# Altium project 天面消防与门禁联动系统.PrjPcb
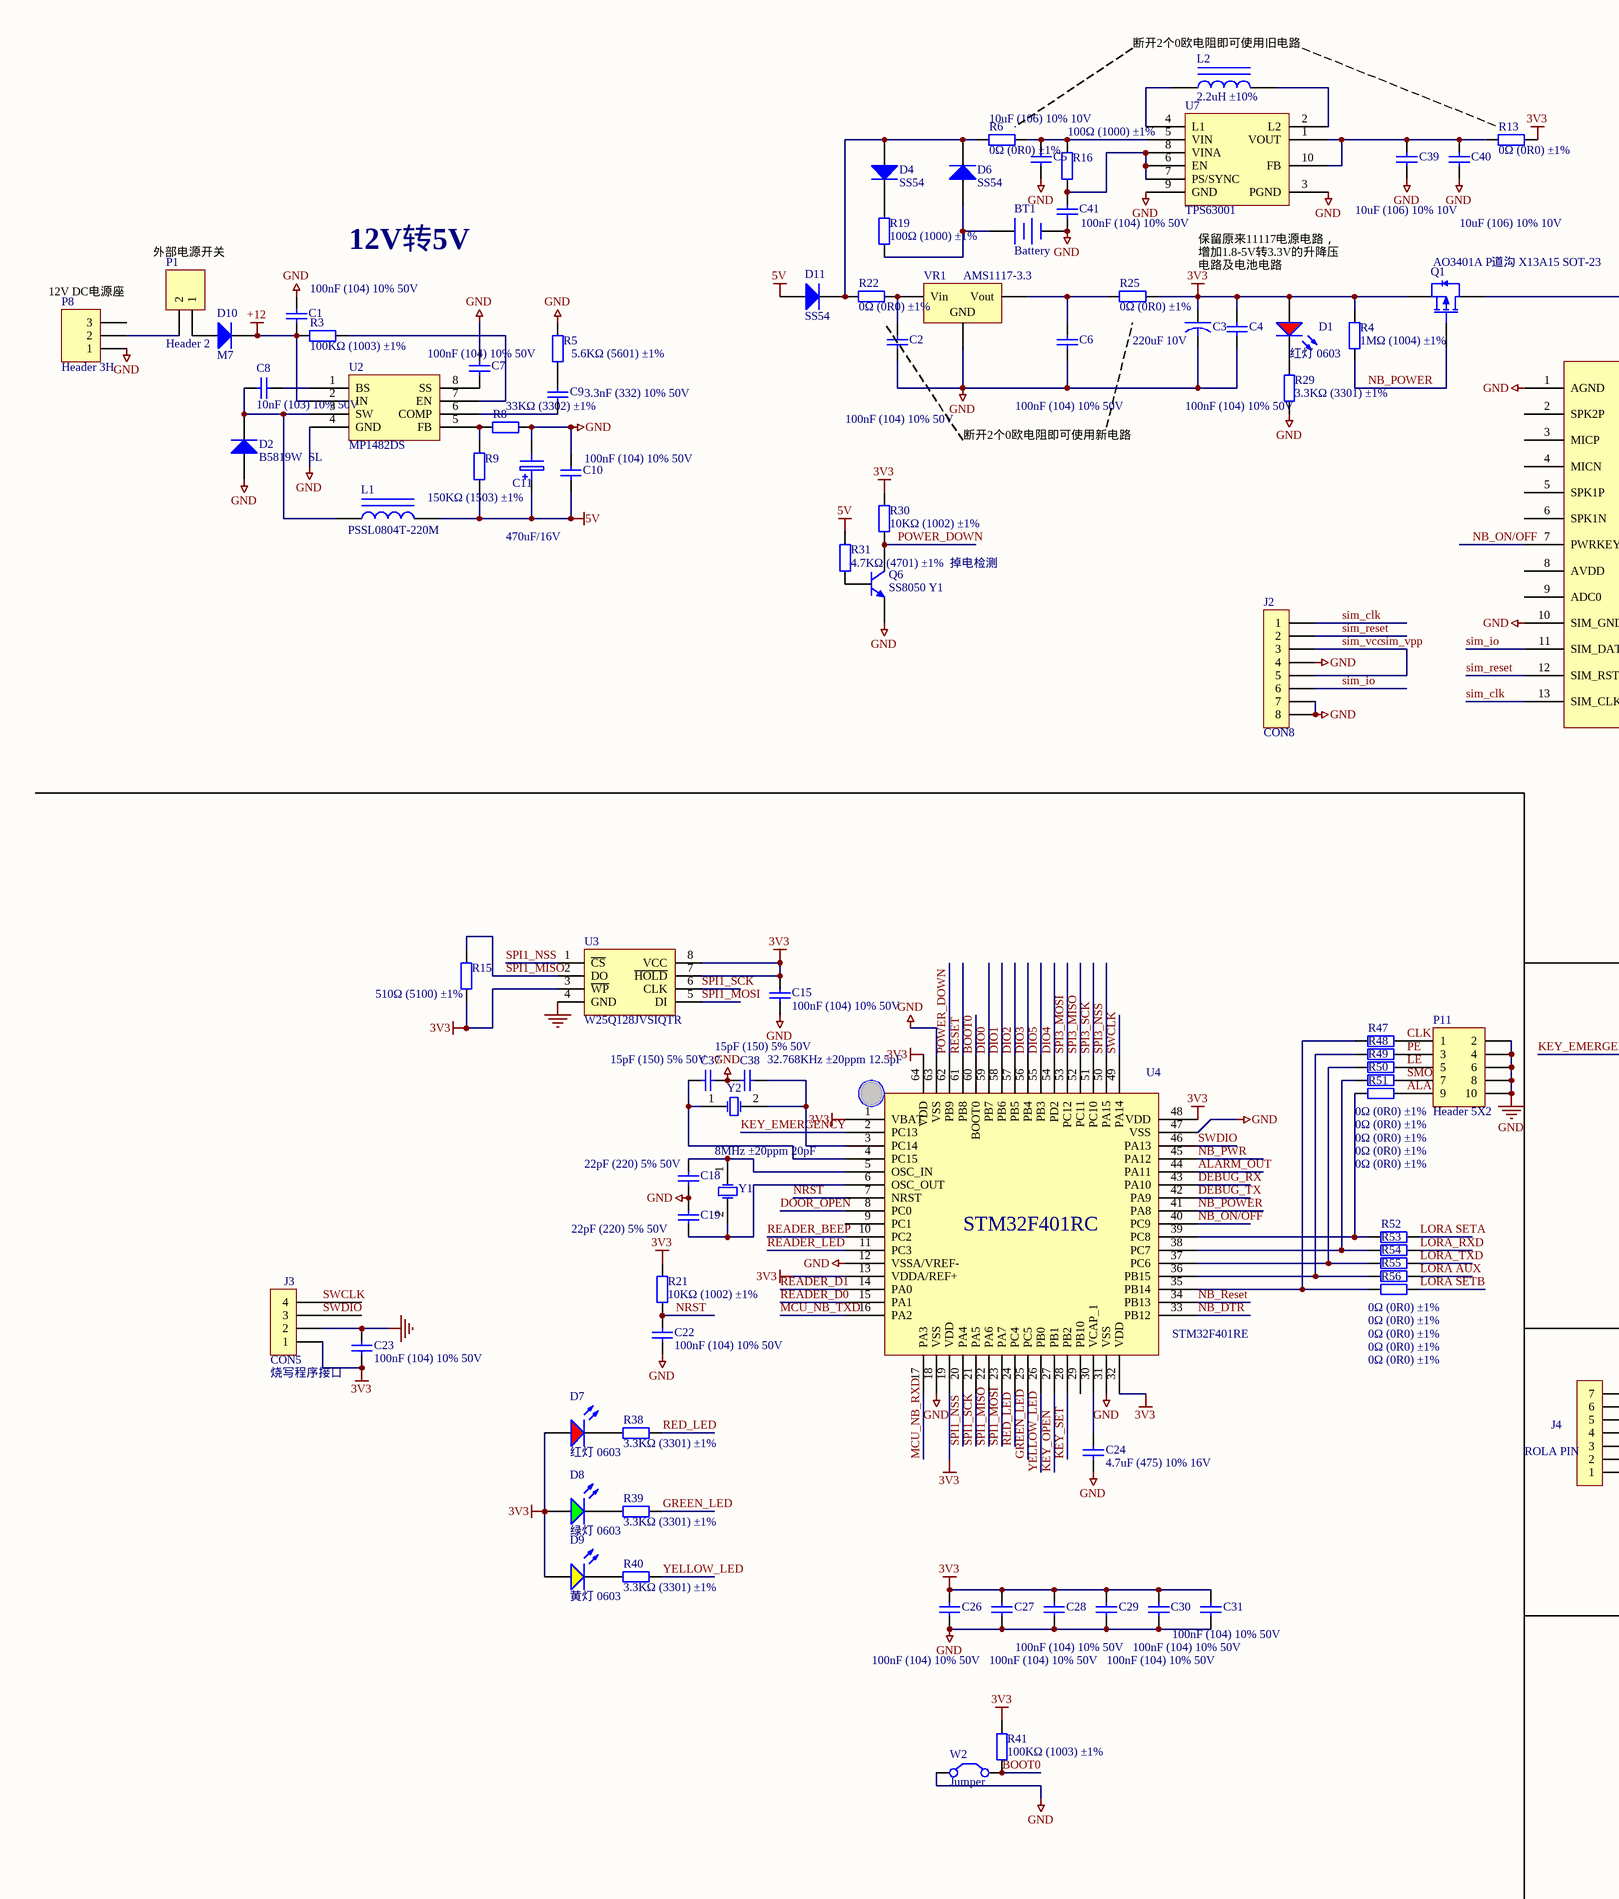
[diagram p0: sch.SchDoc, left]
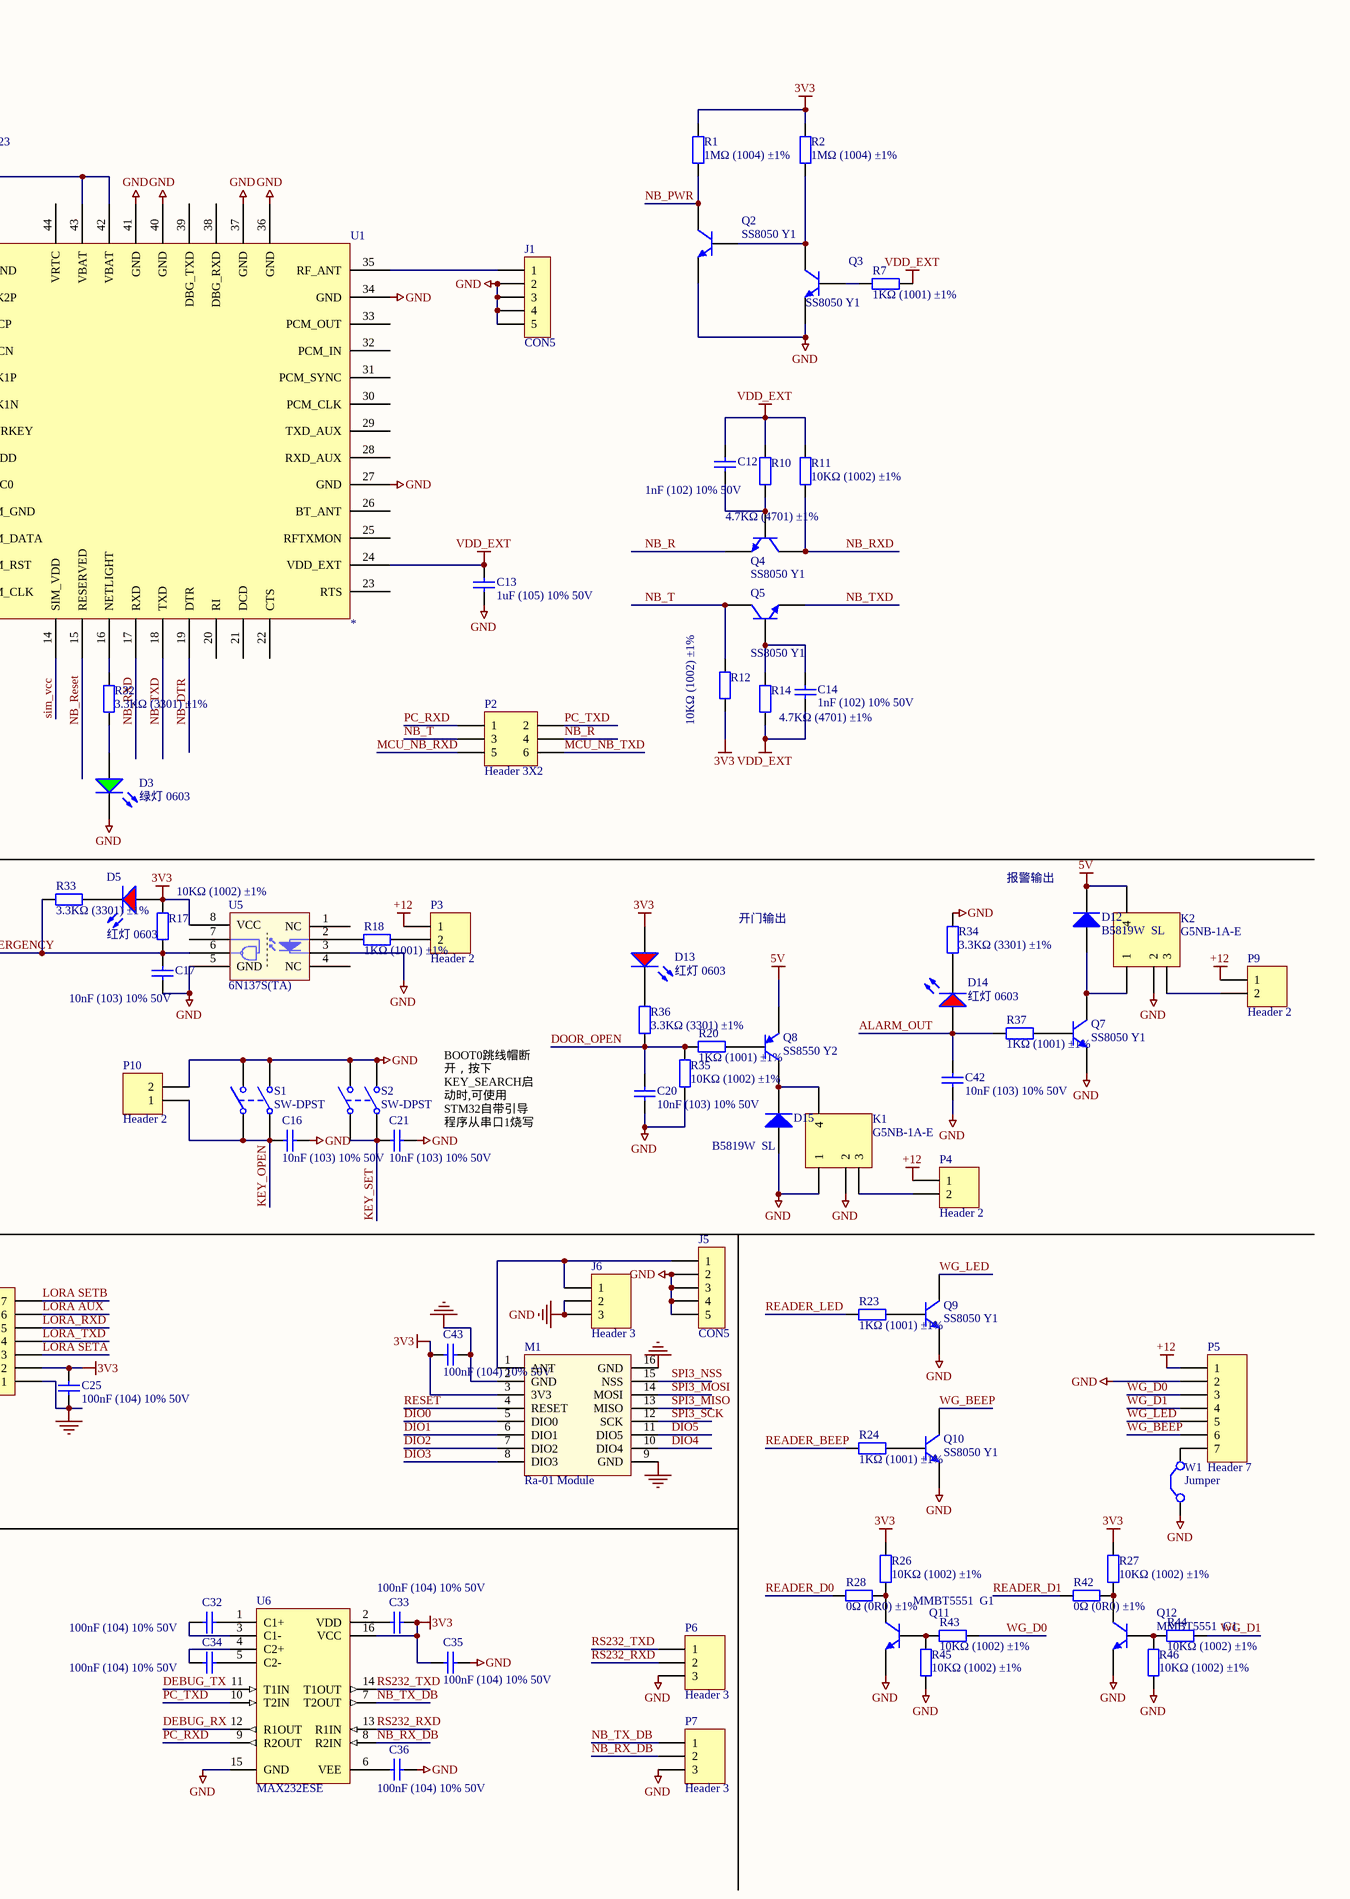
[diagram p1: sch.SchDoc, right]
1 sheet, 163 parts. Net scope: global (net labels, ports and power ports of the same name join across sheets).
Board file: PCB.PcbDoc

## Sheet sch.SchDoc
size A2

### Parts
BT1  Battery  [3V60R]
C1  100nF (104) 10% 50V  [0603_C]
C2  100nF (104) 10% 50V  [0603_C]
C3  220uF 10V  [153CLV-0807]
C4  100nF (104) 10% 50V  [0603_C]
C5  10uF (106) 10% 10V  [0603_C]
C6  100nF (104) 10% 50V  [0603_C]
C7  100nF (104) 10% 50V  [0603_C]
C8  10nF (103) 10% 50V  [0603_C]
C9  3.3nF (332) 10% 50V  [0603_C]
C10  100nF (104) 10% 50V  [0603_C]
C11  470uF/16V  [153CLV-0810]
C12  1nF (102) 10% 50V  [0603_C]
C13  1uF (105) 10% 50V  [0603_C]
C14  1nF (102) 10% 50V  [0603_C]
C15  100nF (104) 10% 50V  [0603_C]
C16  10nF (103) 10% 50V  [0603_C]
C17  10nF (103) 10% 50V  [0603_C]
C18  22pF (220) 5% 50V  [0603_C]
C19  22pF (220) 5% 50V  [0603_C]
C20  10nF (103) 10% 50V  [0603_C]
C21  10nF (103) 10% 50V  [0603_C]
C22  100nF (104) 10% 50V  [0603_C]
C23  100nF (104) 10% 50V  [0603_C]
C24  4.7uF (475) 10% 16V  [0603_C]
C25  100nF (104) 10% 50V  [0603_C]
C26  100nF (104) 10% 50V  [0603_C]
C27  100nF (104) 10% 50V  [0603_C]
C28  100nF (104) 10% 50V  [0603_C]
C29  100nF (104) 10% 50V  [0603_C]
C30  100nF (104) 10% 50V  [0603_C]
C31  100nF (104) 10% 50V  [0603_C]
C32  100nF (104) 10% 50V  [0603_C]
C33  100nF (104) 10% 50V  [0603_C]
C34  100nF (104) 10% 50V  [0603_C]
C35  100nF (104) 10% 50V  [0603_C]
C36  100nF (104) 10% 50V  [0603_C]
C37  15pF (150) 5% 50V  [0603_C]
C38  15pF (150) 5% 50V  [0603_C]
C39  10uF (106) 10% 10V  [0603_C]
C40  10uF (106) 10% 10V  [0603_C]
C41  100nF (104) 10% 50V  [0603_C]
C42  10nF (103) 10% 50V  [0603_C]
C43  100nF (104) 10% 50V  [0603_C]
D1  红灯 0603  [0603_LED_S1]
D2  B5819W  SL  [SOD-123]
D3  绿灯 0603  [0603_LED_S1]
D4  SS54  [SMA(DO-214AC)_S1]
D5  红灯 0603  [0603_LED_S1]
D6  SS54  [SMA(DO-214AC)_S1]
D7  红灯 0603  [0603_LED_S1]
D8  绿灯 0603  [0603_LED_S1]
D9  黄灯 0603  [0603_LED_S1]
D10  M7  [SMA(DO-214AC)_S1]
D11  SS54  [SMA(DO-214AC)_S1]
D12  B5819W  SL  [SOD-123]
D13  红灯 0603  [0603_LED_S1]
D14  红灯 0603  [0603_LED_S1]
D15  B5819W  SL  [SOD-123]
J1  CON5  [T-5P]
J2  CON8  [NANOSIM]
J3  CON5  [SIP4]
J4  ROLA PIN  [ROLA MODULE]
J5  CON5  [T-5P]
J6  Header 3  [COAXIAL/SMD/CON/V/I-PEX/W08-5801]
K1  G5NB-1A-E  [G5NB-1A]
K2  G5NB-1A-E  [G5NB-1A]
L1  PSSL0804T-220M  [L7-8]
L2  2.2uH ±10%  [L4532M]
M1  Ra-01 Module  [Ra-01 Module]
P1  Header 2  [MSTBV2]
P2  Header 3X2  [HDR2X3]
P3  Header 2  [MSTBV2]
P4  Header 2  [MSTBV2]
P5  Header 7  [MSTBV7]
P6  Header 3  [HDR1X3]
P7  Header 3  [HDR1X3]
P8  Header 3H  [POWER_SOCK _INSERT_5]
P9  Header 2  [MSTBV2]
P10  Header 2  [MSTBV2]
P11  Header 5X2  [ML10]
Q1  AO3401A P道沟 X13A15 SOT-23  [SOT-23-3L]
Q2  SS8050 Y1  [SOT-23(SOT-23-3)]
Q3  SS8050 Y1  [SOT-23(SOT-23-3)]
Q4  SS8050 Y1  [SOT-23(SOT-23-3)]
Q5  SS8050 Y1  [SOT-23(SOT-23-3)]
Q6  SS8050 Y1  [SOT-23(SOT-23-3)]
Q7  SS8050 Y1  [SOT-23(SOT-23-3)]
Q8  SS8550 Y2  [SOT-23(SOT-23-3)]
Q9  SS8050 Y1  [SOT-23(SOT-23-3)]
Q10  SS8050 Y1  [SOT-23(SOT-23-3)]
Q11  MMBT5551  G1  [SOT-23(SOT-23-3)]
Q12  MMBT5551  G1  [SOT-23(SOT-23-3)]
R1  1MΩ (1004) ±1%  [0603_R]
R2  1MΩ (1004) ±1%  [0603_R]
R3  100KΩ (1003) ±1%  [0603_R]
R4  1MΩ (1004) ±1%  [0603_R]
R5  5.6KΩ (5601) ±1%  [0603_R]
R6  0Ω (0R0) ±1%  [0603_R]
R7  1KΩ (1001) ±1%  [0603_R]
R8  33KΩ (3302) ±1%  [0603_R]
R9  150KΩ (1503) ±1%  [0603_R]
R10  4.7KΩ (4701) ±1%  [0603_R]
R11  10KΩ (1002) ±1%  [0603_R]
R12  10KΩ (1002) ±1%  [0603_R]
R13  0Ω (0R0) ±1%  [0603_R]
R14  4.7KΩ (4701) ±1%  [0603_R]
R15  510Ω (5100) ±1%  [0603_R]
R16  100Ω (1000) ±1%  [0603_R]
R17  10KΩ (1002) ±1%  [0603_R]
R18  1KΩ (1001) ±1%  [1206_R]
R19  100Ω (1000) ±1%  [0805_R]
R20  1KΩ (1001) ±1%  [0603_R]
R21  10KΩ (1002) ±1%  [0603_R]
R22  0Ω (0R0) ±1%  [0603_R]
R23  1KΩ (1001) ±1%  [0603_R]
R24  1KΩ (1001) ±1%  [0603_R]
R25  0Ω (0R0) ±1%  [0603_R]
R26  10KΩ (1002) ±1%  [0603_R]
R27  10KΩ (1002) ±1%  [0603_R]
R28  0Ω (0R0) ±1%  [0603_R]
R29  3.3KΩ (3301) ±1%  [0603_R]
R30  10KΩ (1002) ±1%  [0603_R]
R31  4.7KΩ (4701) ±1%  [0603_R]
R32  3.3KΩ (3301) ±1%  [0603_R]
R33  3.3KΩ (3301) ±1%  [0603_R]
R34  3.3KΩ (3301) ±1%  [0603_R]
R35  10KΩ (1002) ±1%  [0603_R]
R36  3.3KΩ (3301) ±1%  [0603_R]
R37  1KΩ (1001) ±1%  [0603_R]
R38  3.3KΩ (3301) ±1%  [0603_R]
R39  3.3KΩ (3301) ±1%  [0603_R]
R40  3.3KΩ (3301) ±1%  [0603_R]
R41  100KΩ (1003) ±1%  [0603_R]
R42  0Ω (0R0) ±1%  [0603_R]
R43  10KΩ (1002) ±1%  [0603_R]
R44  10KΩ (1002) ±1%  [0603_R]
R45  10KΩ (1002) ±1%  [0603_R]
R46  10KΩ (1002) ±1%  [0603_R]
R47  0Ω (0R0) ±1%  [0603_R]
R48  0Ω (0R0) ±1%  [0603_R]
R49  0Ω (0R0) ±1%  [0603_R]
R50  0Ω (0R0) ±1%  [0603_R]
R51  0Ω (0R0) ±1%  [0603_R]
R52  0Ω (0R0) ±1%  [0603_R]
R53  0Ω (0R0) ±1%  [0603_R]
R54  0Ω (0R0) ±1%  [0603_R]
R55  0Ω (0R0) ±1%  [0603_R]
R56  0Ω (0R0) ±1%  [0603_R]
S1  SW-DPST  [12*12_key]
S2  SW-DPST  [12*12_key]
U1  *  [M26]
U2  MP1482DS  [SOIC-8_150mil]
U3  W25Q128JVSIQTR  [SOIC-8_208mil]
U4  STM32F401RE  [LQFP64]
U5  6N137S(TA)  [SMD-8_6.3mm]
U6  MAX232ESE  [SOIC-16_150mil]
U7  TPS63001  [DRC-S-PVSON-N10]
VR1  AMS1117-3.3  [SOT-223]
W1  Jumper  [JP1]
W2  Jumper  [JP1]
Y1  8MHz ±20ppm 20pF  [SMD-5032_2P]
Y2  32.768KHz ±20ppm 12.5pF  [SMD-3215_2P FC - 135]

### Nets
3V3: C3.1 C4.2 C15.1 C23.1 C25.1 C26.2 C27.2 C28.2 C29.2 C30.2 C31.2 C33.2 C35.2 C43.1 D1.A D5.A D7.A D8.A D9.A D13.A J3.1 J4.2 M1.3(3V3) Q1.2(S) R1.2 R2.2 R4.2 R12.1 R13.2 R15.1 R17.1 R21.2 R25.2 R26.1 R27.1 R30.2 R41.2 U3.3(~{WP}) U3.7(~{HOLD}) U3.8(VCC) U4.1(VBAT) U4.13(VDDA/REF+) U4.19(VDD) U4.32(VDD) U4.48(VDD) U4.64(VDD) U5.8(VCC) U6.16(VCC)
5V: C10.1 C11.1 D11.1(A) D12.2(K) K2.4 L1.2 Q8.2(E) R9.2 R31.2
+12: C1.2 D10.2(K) P3.1 P4.1 P5.1 P9.1 R3.1 U2.2(IN)
GND: BT1.2(-) C1.1 C2.1 C3.2 C4.1 C5.2 C6.1 C7.1 C10.2 C11.2 C13.1 C15.2 C16.2 C17.1 C18.1 C19.2 C20.2 C21.2 C22.2 C23.2 C24.2 C25.2 C26.1 C27.1 C28.1 C29.1 C30.1 C31.1 C35.1 C36.2 C37.2 C38.1 C39.2 C40.2 C41.2 C42.2 C43.2 D2.1(A) D3.K D15.1(A) J1.2 J1.3 J1.4 J1.5 J2.4 J2.7 J2.8 J3.2 J4.1 J5.2 J5.3 J5.4 J5.5 J6.2 J6.3 K1.1 K1.2 K2.2 M1.2(GND) M1.9(GND) M1.16(GND) P5.2 P6.3 P7.3 P8.1 P10.2 P11.2 P11.4 P11.6 P11.8 P11.10 Q2.2(E) Q3.2(E) Q6.2(E) Q7.2(E) Q9.2(E) Q10.2(E) Q11.2(E) Q12.2(E) R5.2 R8.2 R29.2 R34.1 R35.1 R45.2 R46.2 S1.2(NO1) S1.4(NO2) S2.2(NO1) S2.4(NO2) U1.1(AGND) U1.10(SIM_GND) U1.27(GND) U1.34(GND) U1.36(GND) U1.37(GND) U1.40(GND) U1.41(GND) U2.4(GND) U3.4(GND) U4.12(VSSA/VREF-) U4.18(VSS) U4.31(VSS) U4.47(VSS) U4.63(VSS) U5.3(K) U5.5(GND) U6.15(GND) U7.3(PGND) U7.9(GND) VR1.1(GND) W1.1(C1) W2.1(C1)
VDD_EXT: C12.2 C13.2 C14.1 R7.2 R10.2 R11.2 R14.1 U1.24(VDD_EXT)
ALARM: P11.9 R51.2
ALARM_OUT: C42.1 D14.A R37.1 U4.44(PA11)
BOOT0: R41.1 U4.60(BOOT0) W2.2(C2)
CLK: P11.1 R47.2
DEBUG_RX: U4.43(PA10) U6.12(R1OUT)
DEBUG_TX: U4.42(PA9) U6.11(T1IN)
DIO0: M1.5(DIO0) U4.59(PB7)
DIO1: M1.6(DIO1) U4.58(PB6)
DIO2: M1.7(DIO2) U4.57(PB5)
DIO3: M1.8(DIO3) U4.56(PB4)
DIO4: M1.10(DIO4) U4.54(PD2)
DIO5: M1.11(DIO5) U4.55(PB3)
DOOR_OPEN: C20.1 R20.1 R35.2 R36.1 U4.8(PC0)
GREEN_LED: R39.2 U4.25(PC5)
KEY_EMERGENCY: C17.2 R17.2 R33.1 U4.2(PC13) U5.6(VO)
KEY_OPEN: C16.1 P10.1 S1.1(COMMON1) S1.3(COMMON2) U4.27(PB1)
KEY_SET: C21.1 S2.1(COMMON1) S2.3(COMMON2) U4.28(PB2)
LE: P11.5 R49.2
LORA AUX: J4.6 R55.2
LORA SETA: J4.3 R52.2
LORA SETB: J4.7 R56.2
LORA_RXD: J4.5 R53.2
LORA_TXD: J4.4 R54.2
MCU_NB_RXD: P2.5 U4.17(PA3)
MCU_NB_TXD: P2.6 U4.16(PA2)
NB_DTR: U1.19(DTR) U4.33(PB12)
NB_ON/OFF: U1.7(PWRKEY) U4.40(PC9)
NB_POWER: Q1.1(G) R4.1 U4.41(PA8)
NB_PWR: Q2.3(C) R1.1 U4.45(PA12)
NB_R: P2.4 Q4.2(E)
NB_Reset: U1.15(RESERVED) U4.34(PB13)
NB_RX_DB: P7.2 U6.8(R2IN)
NB_RXD: Q4.3(C) R11.1 U1.17(RXD)
NB_T: P2.3 Q5.3(C) R12.2
NB_TX_DB: P7.1 U6.7(T2OUT)
NB_TXD: Q5.2(E) U1.18(TXD)
NRST: C22.1 R21.1 U4.7(NRST)
PC_RXD: P2.1 U6.9(R2OUT)
PC_TXD: P2.2 U6.10(T2IN)
PE: P11.3 R48.2
POWER_DOWN: Q6.3(C) R30.1 U4.62(PB9)
READER_BEEP: R24.1 U4.10(PC2)
READER_D0: R28.1 U4.15(PA1)
READER_D1: R42.1 U4.14(PA0)
READER_LED: R23.1 U4.11(PC3)
RED_LED: R38.2 U4.24(PC4)
RESET: M1.4(RESET) U4.61(PB8)
RS232_RXD: P6.2 U6.13(R1IN)
RS232_TXD: P6.1 U6.14(T1OUT)
sim_clk: J2.1 U1.13(SIM_CLK)
sim_io: J2.6 U1.11(SIM_DATA)
sim_reset: J2.2 U1.12(SIM_RST)
sim_vcc: J2.3 J2.5 U1.14(SIM_VDD)  [also labelled sim_vpp]
SMOKE_IN: P11.7 R50.2
SPI1_MISO: R15.2 U3.2(DO) U4.22(PA6)
SPI1_MOSI: U3.5(DI) U4.23(PA7)
SPI1_NSS: U3.1(~{CS}) U4.20(PA4)
SPI1_SCK: U3.6(CLK) U4.21(PA5)
SPI3_MISO: M1.13(MISO) U4.52(PC11)
SPI3_MOSI: M1.14(MOSI) U4.53(PC12)
SPI3_NSS: M1.15(NSS) U4.50(PA15)
SPI3_SCK: M1.12(SCK) U4.51(PC10)
SWCLK: J3.4 U4.49(PA14)
SWDIO: J3.3 U4.46(PA13)
WG_BEEP: P5.6 Q10.3(C)
WG_D0: P5.3 R43.2
WG_D1: P5.4 R44.2
WG_LED: P5.5 Q9.3(C)
YELLOW_LED: R40.2 U4.26(PB0)
NetBT1_1: BT1.1(+) D6.1(A) R19.2
NetC2_2: C2.2 R22.2 VR1.3(Vin)
NetC5_1: C5.1 R6.2 R16.2 U7.5(VIN)
NetC6_2: C6.2 R25.1 VR1.2(Vout)
NetC7_2: C7.2 U2.8(SS)
NetC8_1: C8.1 D2.2(K) L1.1 U2.3(SW)
NetC8_2: C8.2 U2.1(BS)
NetC9_1: C9.1 R5.1
NetC9_2: C9.2 U2.6(COMP)
NetC12_1: C12.1 Q4.1(B) R10.1
NetC14_2: C14.2 Q5.1(B) R14.2
NetC18_2: C18.2 U4.5(OSC_IN) Y1.1(OSC1)
NetC19_1: C19.1 U4.6(OSC_OUT) Y1.2(OSC2)
NetC24_1: C24.1 U4.30(VCAP_1)
NetC32_1: C32.1 U6.3(C1-)
NetC32_2: C32.2 U6.1(C1+)
NetC33_1: C33.1 U6.2(VDD)
NetC34_1: C34.1 U6.4(C2+)
NetC34_2: C34.2 U6.5(C2-)
NetC36_1: C36.1 U6.6(VEE)
NetC37_1: C37.1 U4.4(PC15) Y2.1(OSC1)
NetC38_2: C38.2 U4.3(PC14) Y2.2(OSC2)
NetC39_1: C39.1 C40.1 R13.1 U7.1(VOUT) U7.10(FB)
NetC41_1: C41.1 R16.1 U7.6(EN) U7.7(PS/SYNC) U7.8(VINA)
NetD1_K: D1.K R29.1
NetD3_A: D3.A R32.2
NetD4_1: D4.1(A) D6.2(K) D11.2(K) R6.1 R22.1
NetD4_2: D4.2(K) R19.1
NetD5_K: D5.K R33.2
NetD7_K: D7.K R38.1
NetD8_K: D8.K R39.1
NetD9_K: D9.K R40.1
NetD10_1: D10.1(A) P1.1
NetD12_1: D12.1(A) K2.1 Q7.3(C)
NetD13_K: D13.K R36.2
NetD14_K: D14.K R34.2
NetD15_2: D15.2(K) K1.4 Q8.3(C)
NetJ1_1: J1.1 U1.35(RF_ANT)
NetJ5_1: J5.1 J6.1 M1.1(ANT)
NetK1_3: K1.3 P4.2
NetK2_3: K2.3 P9.2
NetL2_1: L2.1 U7.4(L1)
NetL2_2: L2.2 U7.2(L2)
NetP1_2: P1.2 P8.2
NetP3_2: P3.2 R18.2
NetP5_7: P5.7 W1.2(C2)
NetQ1_3: Q1.3(D) U1.42(VBAT) U1.43(VBAT)
NetQ2_1: Q2.1(B) Q3.3(C) R2.1
NetQ3_1: Q3.1(B) R7.1
NetQ6_1: Q6.1(B) R31.1
NetQ7_1: Q7.1(B) R37.2
NetQ8_1: Q8.1(B) R20.2
NetQ9_1: Q9.1(B) R23.2
NetQ10_1: Q10.1(B) R24.2
NetQ11_1: Q11.1(B) R43.1 R45.1
NetQ11_3: Q11.3(C) R26.2 R28.2
NetQ12_1: Q12.1(B) R44.1 R46.1
NetQ12_3: Q12.3(C) R27.2 R42.2
NetR3_2: R3.2 U2.7(EN)
NetR8_1: R8.1 R9.1 U2.5(FB)
NetR18_1: R18.1 U5.2(A)
NetR32_1: R32.1 U1.16(NETLIGHT)
NetR47_1: R47.1 R56.1 U4.35(PB14)
NetR48_1: R48.1 R55.1 U4.36(PB15)
NetR49_1: R49.1 R54.1 U4.37(PC6)
NetR50_1: R50.1 R53.1 U4.38(PC7)
NetR51_1: R51.1 R52.1 U4.39(PC8)

Not connected (* = marked no-connect by the designer): P8 3; U1 2(SPK2P) 3(MICP) 4(MICN) 5(SPK1P) 6(SPK1N) 8(AVDD) 9(ADC0) 20(RI) 21(DCD) 22(CTS) 23(RTS) 25(RFTXMON) 26(BT_ANT) 28(RXD_AUX) 29(TXD_AUX) 30(PCM_CLK) 31(PCM_SYNC) 32(PCM_IN) 33(PCM_OUT) 38(DBG_RXD) 39(DBG_TXD) 44(VRTC); U4 9(PC1) 29(PB10); U5 1(NC) 4(NC) 7(VE)

### Notes on the sheet
- (near L2) 断开2个0欧电阻即可使用旧电路
- 外部电源开关
- 12V转5V
- 保留原来11117电源电路，
  增加1.8-5V转3.3V的升降压
  电路及电池电路
- (near P8) 12V DC电源座
- 断开2个0欧电阻即可使用新电路
- 掉电检测
- 报警输出
- 开门输出
- BOOT0跳线帽断开，按下KEY_SEARCH启动时,可使用STM32自带引导程序从串口1烧写程序
- (near J3) 烧写程序接口

### Library data of the parts
BT1 = Battery: Multicell Battery; Published: 24-Mar-1999; LatestRevisionDate: 17-Jul-2002; LatestRevisionNote: Re-released for DXP Platform.; PackageReference: BAT-2; Publisher: Altium Limited; PackageDescription: Battery; 2 Leads
C1 C2 C4 C6 C7 C10 C15 C22 C23 C25-C36 C41 C43 = 0603 100nF (104) 10% 50V: 贴片电容; ComponentLink1Description: 供应商链接; ComponentLink1URL: http://www.szlcsc.com/product/details_15331.html; Package: 0603; Supplier: LC; SuppliersPartNumber: C14663
C3 = CAPACITOR
C5 C39 C40 = 0603 10uF (106) 10% 10V: 贴片电容; ComponentLink1Description: 供应商链接; ComponentLink1URL: http://www.szlcsc.com/product/details_20411.html; Package: 0603; Supplier: LC; SuppliersPartNumber: C19702
C8 C16 C17 C20 C21 C42 = 0603 10nF (103) 10% 50V: 贴片电容; ComponentLink1Description: 供应商链接; ComponentLink1URL: http://www.szlcsc.com/product/details_58143.html; Package: 0603; Supplier: LC; SuppliersPartNumber: C57112
C9 = 0603 3.3nF (332) 10% 50V: 贴片电容; ComponentLink1Description: 供应商链接; ComponentLink1URL: http://www.szlcsc.com/product/details_1965.html; Package: 0603; Supplier: LC; SuppliersPartNumber: C1613
C11 = ELECTRO1: Electrolytic Capacitor
C12 C14 = 0603 1nF (102) 10% 50V: 贴片电容; ComponentLink1Description: 供应商链接; ComponentLink1URL: http://www.szlcsc.com/product/details_1940.html; Package: 0603; Supplier: LC; SuppliersPartNumber: C1588
C13 = 0603 1uF (105) 10% 50V: 贴片电容; ComponentLink1Description: 供应商链接; ComponentLink1URL: http://www.szlcsc.com/product/details_16531.html; Package: 0603; Supplier: LC; SuppliersPartNumber: C15849
C18 C19 = 0603 22pF (220) 5% 50V: 贴片电容; ComponentLink1Description: 供应商链接; ComponentLink1URL: http://www.szlcsc.com/product/details_2005.html; Package: 0603; Supplier: LC; SuppliersPartNumber: C1653
C24 = 0603 4.7uF (475) 10% 16V: 贴片电容; ComponentLink1Description: 供应商链接; ComponentLink1URL: http://www.szlcsc.com/product/details_20375.html; Package: 0603; Supplier: LC; SuppliersPartNumber: C19666
C37 C38 = 0603 15pF (150) 5% 50V: 贴片电容; ComponentLink1Description: 供应商链接; ComponentLink1URL: http://www.szlcsc.com/product/details_1996.html; Package: 0603; Supplier: LC; SuppliersPartNumber: C1644
D1 D5 D7 D13 D14 = 0603 红灯: 发光二极管; ComponentLink1Description: 供应商链接; ComponentLink1URL: http://www.szlcsc.com/product/details_2659.html; Package: 0603; Supplier: LC; SuppliersPartNumber: C2286
D2 D12 D15 = SOD-123 B5819W  SL: 肖特基二极管; ComponentLink1Description: 供应商链接; ComponentLink1URL: http://www.szlcsc.com/product/details_9093.html; Package: SOD-123; Supplier: LC; SuppliersPartNumber: C8598
D3 D8 = 0603 绿灯: 发光二极管; ComponentLink1Description: 供应商链接; ComponentLink1URL: http://www.szlcsc.com/product/details_73152.html; Package: 0603; Supplier: LC; SuppliersPartNumber: C72043
D4 D6 D11 = SMA(DO-214AC) SS54: 二极管; ComponentLink1Description: 供应商链接; ComponentLink1URL: http://www.szlcsc.com/product/details_23178.html; Package: SMA(DO-214AC); Supplier: LC; SuppliersPartNumber: C22452
D9 = 0603 黄灯: 发光二极管; ComponentLink1Description: 供应商链接; ComponentLink1URL: http://www.szlcsc.com/product/details_73147.html; Package: 0603; Supplier: LC; SuppliersPartNumber: C72038
D10 = SMA(DO-214AC) M7: 二极管; Notepad: 1N4007 4007 编号C2464 已经停售, 使用新物料编号C95872; ComponentLink1Description: 供应商链接; ComponentLink1URL: http://www.szlcsc.com/product/details_2841.html; Package: SMA(DO-214AC); Supplier: LC; SuppliersPartNumber: C95872
J1 J5 = CON5: Connector
J2 = CON8: Connector
J3 = CON4: Connector
J4 = CON7: Connector
J6 P6 P7 = Header 3: Header, 3-Pin; LatestRevisionDate: 17-Jul-2002; LatestRevisionNote: Re-released for DXP Platform.; Publisher: Altium Limited
L1 = INDUCTOR IRON
L2 = 0805 2.2uH 10%: 贴片电感; ComponentLink1Description: 供应商链接; ComponentLink1URL: http://www.szlcsc.com/product/details_1395.html; Package: 0805; Supplier: LC; SuppliersPartNumber: C1043
P1 P3 P4 P9 P10 = Header 2: Header, 2-Pin; LatestRevisionDate: 17-Jul-2002; LatestRevisionNote: Re-released for DXP Platform.; Publisher: Altium Limited
P2 = Header 3X2: Header, 3-Pin, Dual row; LatestRevisionDate: 17-Jul-2002; LatestRevisionNote: Re-released for DXP Platform.; Publisher: Altium Limited
P5 = Header 7: Header, 7-Pin; LatestRevisionDate: 17-Jul-2002; LatestRevisionNote: Re-released for DXP Platform.; Publisher: Altium Limited
P8 = Header 3H: Header, 3-Pin, Right Angle; LatestRevisionDate: 17-Jul-2002; LatestRevisionNote: Re-released for DXP Platform.; Publisher: Altium Limited
P11 = Header 5X2: Header, 5-Pin, Dual row; LatestRevisionDate: 17-Jul-2002; LatestRevisionNote: Re-released for DXP Platform.; Publisher: Altium Limited
Q1 = AO3401A P道沟 X13A15 SOT-23: MOS(场效应管); ComponentLink1Description: 供应商链接; ComponentLink1URL: http://www.szlcsc.com/product/details_15801.html; Package: SOT-23; Supplier: LC; SuppliersPartNumber: C15127
Q2-Q7 Q9 Q10 = SOT-23 SS8050 Y1: 三极管; ComponentLink1Description: 供应商链接; ComponentLink1URL: http://www.szlcsc.com/product/details_2507.html; Package: SOT-23; Supplier: LC; SuppliersPartNumber: C2150
Q8 = SOT-23 SS8550 Y2: 三极管; ComponentLink1Description: 供应商链接; ComponentLink1URL: http://www.szlcsc.com/product/details_9037.html; Package: SOT-23; Supplier: LC; SuppliersPartNumber: C8542
Q11 Q12 = SOT-23 MMBT5551  G1: 三极管; ComponentLink1Description: 供应商链接; ComponentLink1URL: http://www.szlcsc.com/product/details_2502.html; Package: SOT-23; Supplier: LC; SuppliersPartNumber: C2145
R1 R2 R4 = 0603 1MΩ (1004) 1%: 贴片电阻; ComponentLink1Description: 供应商链接; ComponentLink1URL: http://www.szlcsc.com/product/details_23662.html; Package: 0603; Supplier: LC; SuppliersPartNumber: C22935
R3 R41 = 0603 100KΩ (1003) 1%: 贴片电阻; ComponentLink1Description: 供应商链接; ComponentLink1URL: http://www.szlcsc.com/product/details_26546.html; Package: 0603; Supplier: LC; SuppliersPartNumber: C25803
R5 = 0603 5.6KΩ (5601) 1%: 贴片电阻; ComponentLink1Description: 供应商链接; ComponentLink1URL: http://www.szlcsc.com/product/details_23916.html; Package: 0603; Supplier: LC; SuppliersPartNumber: C23189
R6 R13 R22 R25 R28 R42 R47-R56 = 0603 0Ω (0R0) 1%: 贴片电阻; ComponentLink1Description: 供应商链接; ComponentLink1URL: http://www.szlcsc.com/product/details_21903.html; Package: 0603; Supplier: LC; SuppliersPartNumber: C21189
R7 R20 R23 R24 R37 = 0603 1KΩ (1001) 1%: 贴片电阻; ComponentLink1Description: 供应商链接; ComponentLink1URL: http://www.szlcsc.com/product/details_21904.html; Package: 0603; Supplier: LC; SuppliersPartNumber: C21190
R8 = 0603 33KΩ (3302) 1%: 贴片电阻; ComponentLink1Description: 供应商链接; ComponentLink1URL: http://www.szlcsc.com/product/details_4623.html; Package: 0603; Supplier: LC; SuppliersPartNumber: C4216
R9 = 0603 150KΩ (1503) 1%: 贴片电阻; ComponentLink1Description: 供应商链接; ComponentLink1URL: http://www.szlcsc.com/product/details_23534.html; Package: 0603; Supplier: LC; SuppliersPartNumber: C22807
R10 R14 R31 = 0603 4.7KΩ (4701) 1%: 贴片电阻; ComponentLink1Description: 供应商链接; ComponentLink1URL: http://www.szlcsc.com/product/details_23889.html; Package: 0603; Supplier: LC; SuppliersPartNumber: C23162
R11 R12 R17 R21 R26 R27 R30 R35 R43-R46 = 0603 10KΩ (1002) 1%: 贴片电阻; ComponentLink1Description: 供应商链接; ComponentLink1URL: http://www.szlcsc.com/product/details_26547.html; Package: 0603; Supplier: LC; SuppliersPartNumber: C25804
R15 = 0603 510Ω (5100) 1%: 贴片电阻; ComponentLink1Description: 供应商链接; ComponentLink1URL: http://www.szlcsc.com/product/details_23920.html; Package: 0603; Supplier: LC; SuppliersPartNumber: C23193
R16 = 0603 100Ω (1000) 1%: 贴片电阻; ComponentLink1Description: 供应商链接; ComponentLink1URL: http://www.szlcsc.com/product/details_23502.html; Package: 0603; Supplier: LC; SuppliersPartNumber: C22775
R18 = 1206 1KΩ (1001) 1%: 贴片电阻; ComponentLink1Description: 供应商链接; ComponentLink1URL: http://www.szlcsc.com/product/details_4817.html; Package: 1206; Supplier: LC; SuppliersPartNumber: C4410
R19 = 0805 100Ω (1000) 1%: 贴片电阻; ComponentLink1Description: 供应商链接; ComponentLink1URL: http://www.szlcsc.com/product/details_18096.html; Package: 0805; Supplier: LC; SuppliersPartNumber: C17408
R29 R32-R34 R36 R38-R40 = 0603 3.3KΩ (3301) 1%: 贴片电阻; ComponentLink1Description: 供应商链接; ComponentLink1URL: http://www.szlcsc.com/product/details_23705.html; Package: 0603; Supplier: LC; SuppliersPartNumber: C22978
S1 S2 = SW-DPST: Double-Pole, Single-Throw Switch; Published: 24-Mar-1999; LatestRevisionDate: 17-Jul-2002; LatestRevisionNote: Re-released for DXP Platform.; PackageReference: DPST-4; Publisher: Altium Limited; PackageDescription: Switch; 4 Leads
U1 = M26
U2 = MP1482DS_[C14867]: 电源芯片; ComponentLink1Description: 供应商链接; ComponentLink1URL: http://www.szlcsc.com/product/details_15539.html; Package: SOIC-8_150mil; Supplier: LC; SuppliersPartNumber: C14867
U3 = W25Q128JVSIQTR_[C97521]: Flash ROM; ComponentLink1Description: 供应商链接; ComponentLink1URL: https://item.szlcsc.com/98729.html; Package: SOIC-8; Supplier: LC; SuppliersPartNumber: C97521
U4 = STM32F401RC
U5 = 6N137S(TA)_[C16496]: 贴片光耦; ComponentLink1Description: 供应商链接; ComponentLink1URL: http://www.szlcsc.com/product/details_17178.html; Package: SMD-8_6.3mm; Supplier: LC; SuppliersPartNumber: C16496
U6 = MAX232ESE_[C26860]: RS232; ComponentLink1Description: 供应商链接; ComponentLink1URL: http://www.szlcsc.com/product/details_27608.html; Package: SOIC-16_150mil; Supplier: LC; SuppliersPartNumber: C26860
VR1 = SOT-223 AMS1117-3.3: 低压差线性稳压(LDO); ComponentLink1Description: 供应商链接; ComponentLink1URL: http://www.szlcsc.com/product/details_6652.html; Package: SOT-223; Supplier: LC; SuppliersPartNumber: C6186
W1 W2 = Jumper: Jumper Wire; Published: 24-Mar-1999; LatestRevisionDate: 17-Jul-2002; LatestRevisionNote: Re-released for DXP Platform.; PackageReference: RAD-0.2; Publisher: Altium Limited; PackageDescription: Radial Cap, Thru-Hole; 2 Leads; 0.2 in Pin Spacing
Y1 = SMD-5032_2P 8MHz 20ppm 20pF: 贴片晶振; ComponentLink1Description: 供应商链接; ComponentLink1URL: http://www.szlcsc.com/product/details_117214.html; Package: SMD-5032_2P; Supplier: LC; SuppliersPartNumber: C115962
Y2 = SMD-3215_2P 32.768KHz 20ppm 12.5pF: 贴片晶振; ComponentLink1Description: 供应商链接; ComponentLink1URL: http://www.szlcsc.com/product/details_33310.html; Package: SMD-3215_2P; Supplier: LC; SuppliersPartNumber: C32346